# EAGLE design LPC_4TE_3.53controller (EAGLE 5.04)
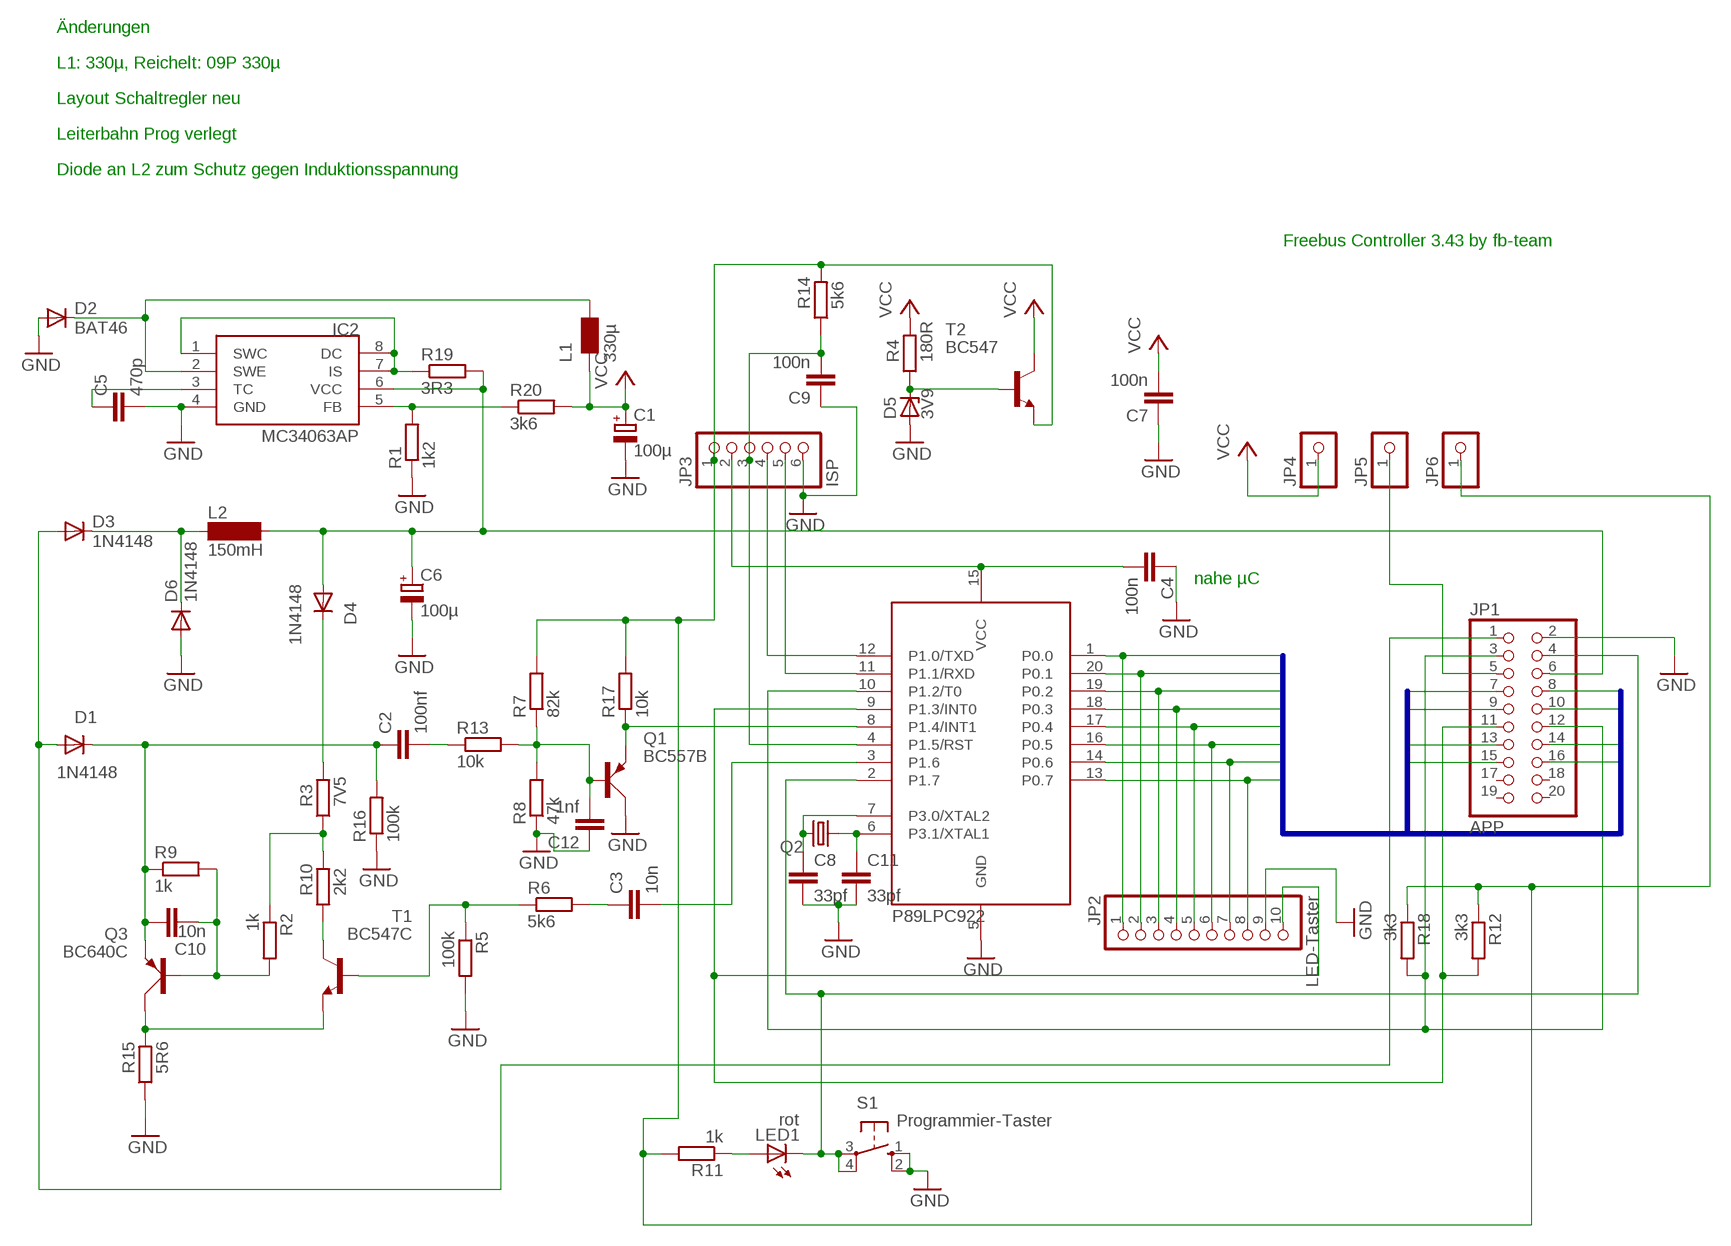
[diagram p0: schematic, sheet 1]

## Parts
C1  100µ  CPOL-EUE5-8.5  [E5-8,5]
C2  100nf  C-EU050-024X044  [C050-024X044]
C3  10n  C-EU050-024X044  [C050-024X044]
C4  100n  C-EU050-024X044  [C050-024X044]
C5  470p  C-EU025-024X044  [C025-024X044]
C6  100µ  CPOL-EUE5-8.5  [E5-8,5]
C7  100n  C-EU050-024X044  [C050-024X044]
C8  33pf  C-EUC1206  [C1206]
C9  100n  C-EU050-024X044  [C050-024X044]
C10  10n  C-EU050-024X044  [C050-024X044]
C11  33pf  C-EUC1206  [C1206]
C12  1nf  C-EU050-024X044  [C050-024X044]
D1  1N4148  1N4148DO35-7  [DO35-7]
D2  BAT46  DIODE-C1702-05  [C1702-05]
D3  1N4148  DIODE-D-2.5  [D-2.5]
D4  1N4148  1N4148DO35-10  [DO35-10]
D5  3V9  BZX85ZD-VL  [RAD2,5L]
D6  1N4148  DIODE-D-2.5  [D-2.5]
IC1  89LPC922FN  89LPC922  [DIL20]
IC2  MC34063AP  [DIL08]
JP1  APP  PINHD-2X10  [2X10]
JP2  LED-Taster  PINHD-1X10  [1X10]
JP3  ISP  PINHD-1X6  [1X06]
JP4  PINHD-1X1  [1X01]
JP5  PINHD-1X1  [1X01]
JP6  PINHD-1X1  [1X01]
L1  330µ  L_R85  [L_RAD_D8RM5]
L2  150mH  SD12-1000  [SD12_1000]
LED1  rot  LED3MM  [LED3MM]
Q1  BC557B  BC557  [SOT54A]
Q2  CRYSTALHC49U70  [HC49U70]
Q3  BC640C  BC640  [SOT54D]
R1  1k2  R-EU_0207/10  [0207/10]
R2  1k  R-EU_0207/7  [0207/7]
R3  7V5  R-EU_0207/7  [0207/7]
R4  180R  R-EU_0207/2V  [0207/2V]
R5  100k  R-EU_0207/2V  [0207/2V]
R6  5k6  R-EU_0207/7  [0207/7]
R7  82k  R-EU_0207/7  [0207/7]
R8  47k  R-EU_0207/7  [0207/7]
R9  1k  R-EU_0207/7  [0207/7]
R10  2k2  R-EU_0207/7  [0207/7]
R11  1k  R-EU_0207/10  [0207/10]
R12  3k3  R-EU_0207/10  [0207/10]
R13  10k  R-EU_0207/7  [0207/7]
R14  5k6  R-EU_0207/10  [0207/10]
R15  5R6  R-EU_0207/2V  [0207/2V]
R16  100k  R-EU_0207/7  [0207/7]
R17  10k  R-EU_0207/7  [0207/7]
R18  3k3  R-EU_0207/10  [0207/10]
R19  3R3  R-EU_0207/10  [0207/10]
R20  3k6  R-EU_0207/10  [0207/10]
S1  Programmier-Taster  10-XX  [B3F-10XX]
T1  BC547C  BC547  [TO92]
T2  BC547  [TO92]

## Nets
/RESTET: C9.2 IC1.4(P1.5/RST) JP3.3 R14.1
DRAIN: C2.1 C10.1 D1.C Q3.E R9.1 R16.2
EIB_DC: C6.+ D4.A IC2.6(VCC) JP1.6 L2.2 R19.2
EIBIN: IC1.8(P1.4/INT1) Q1.E R17.1
GND: C1.- C4.1 C5.2 C6.- C7.1 C8.2 C9.1 C11.2 C12.1 D2.A D5.A D6.A IC1.5(GND) IC2.4(GND) JP1.2 JP2.9 JP3.6 Q1.C R1.1 R5.2 R8.1 R15.1 R16.1 S1.1(S) S1.2(S1)
INT0_TASTER: IC1.9(P1.3/INT0) JP1.11 JP2.10 R12.2
N$1: C3.1 R6.2
N$2: C2.2 R13.1
N$3: IC2.5(FB) R1.2 R20.1
N$4: IC2.1(SWC) IC2.7(IS) IC2.8(DC) R19.1
N$5: C3.2 IC1.3(P1.6)
N$6: R10.1 T1.3(C)
N$7: Q3.C R15.2 T1.1(E)
N$8: D3.C D6.C L2.1
N$9: D4.C R3.2
N$10: D2.C IC2.2(SWE) L1.1
N$11: R2.1 R3.1 R10.2
N$12: R5.1 R6.1 T1.2(B)
N$13: C5.1 IC2.3(TC)
N$14: C12.2 Q1.B R7.1 R8.2 R13.2
N$15: C10.2 Q3.B R2.2 R9.2
N$16: D1.A D3.A JP1.1
N$17: C11.1 IC1.6(P3.1/XTAL1) Q2.1
N$18: D5.C R4.1 T2.2(B)
N$19: C8.1 IC1.7(P3.0/XTAL2) Q2.2
N$20: JP1.5 JP5.1
N$29: IC1.12(P1.0/TXD) JP3.4
N$30: IC1.11(P1.1/RXD) JP3.5
N$41: LED1.A R11.1
P0.0: IC1.1(P0.0) JP1.7 JP2.1
P0.1: IC1.20(P0.1) JP1.8 JP2.2
P0.2: IC1.19(P0.2) JP1.9 JP2.3
P0.3: IC1.18(P0.3) JP1.10 JP2.4
P0.4: IC1.17(P0.4) JP1.13 JP2.5
P0.5: IC1.16(P0.5) JP1.14 JP2.6
P0.6: IC1.14(P0.6) JP1.15 JP2.7
P0.7: IC1.13(P0.7) JP1.16 JP2.8
PROG: IC1.2(P1.7) JP1.4 LED1.K(C) S1.3(P) S1.4(P1)
PWM: IC1.10(P1.2/T0) JP1.3 JP1.12 R18.2
VCC: C1.+ C7.2 JP4.1 L1.2 R4.2 R20.2 T2.3(C)
VCC_3V3: JP3.1 JP6.1 R7.2 R11.2 R12.1 R14.2 R17.2 R18.1 T2.1(E)
VCC_LPC: C4.2 IC1.15(VCC) JP3.2
Unconnected: JP1.17 JP1.18 JP1.19 JP1.20

## Buses
P0.[0..7]

## Notes on the sheet
- Änderungen
- L1: 330µ, Reichelt: 09P 330µ
- Layout Schaltregler neu
- Leiterbahn Prog verlegt
- Diode an L2 zum Schutz gegen Induktionsspannung
- Freebus Controller 3.43 by fb-team
- nahe µC
- P89LPC922

## Library data of the parts
C1 C6 = rcl:CPOL-EU: POLARIZED CAPACITOR, European symbol
C2-C5 C7-C12 = rcl:C-EU: CAPACITOR, European symbol
D1 D4 = diode:1N4148: DIODE high speed (Philips)
D2 D3 D6 = diode:DIODE-: DIODE
D5 = diode:BZX85: Z DIODE
IC1 = micro-philips:89LPC922
IC2 = mc34063:MC34063
JP1 = pinhead:PINHD-2X10: PIN HEADER
JP2 = pinhead:PINHD-1X10: PIN HEADER
JP3 = pinhead:PINHD-1X6: PIN HEADER
JP4-JP6 = pinhead:PINHD-1X1: PIN HEADER
L1 = fbctrls1:L
L2 = inductor-neosid:SD12: INDUCTOR nominal inductance
LED1 = led:LED: LED OSRAM: - CHIPLED LG R971, LG N971, LY N971, LG Q971, LY Q971, LO R971, LY R971 LH N974, LH R974 LS Q976, LO Q976, LY Q976 LO Q996 - Hyper CHIPLED LW Q18S LB Q993, LB Q99A, LB R99A - SideLED LS A670, LO A670, LY A670, LG A670, LP A670 LB A673, LV A673, LT A673, LW A673 LH A674 LY A675 LS A676, LA A676, LO A676, LY A676, LW A676 LS A679, LY A679, LG A679 - Hyper Micro SIDELED® LS Y876, LA Y876, LO Y876, LY Y876 LT Y87S - SmartLED LW L88C, LW L88S LB L89C, LB L89S, LG L890 LS L89K, LO L89K, LY L89K LS L896, LA L896, LO L896, LY L896 - TOPLED LS T670, LO T670, LY T670, LG T670, LP T670 LSG T670, LSP T670, LSY T670, LOP T670, LYG T670 LG T671, LOG T671, LSG T671 LB T673, LV T673, LT T673, LW T673 LH T674 LS T676, LA T676, LO T676, LY T676, LB T676, LH T676, LSB T676, LW T676 LB T67C, LV T67C, LT T67C, LS T67K, LO T67K, LY T67K, LW E67C LS E67B, LA E67B, LO E67B, LY E67B, LB E67C, LV E67C, LT E67C LW T67C LS T679, LY T679, LG T679 LS T770, LO T770, LY T770, LG T770, LP T770 LB T773, LV T773, LT T773, LW T773 LH T774 LS E675, LA E675, LY E675, LS T675 LS T776, LA T776, LO T776, LY T776, LB T776 LHGB T686 LT T68C, LB T68C - Hyper Mini TOPLED® LB M676 - Mini TOPLED Santana® LG M470 LS M47K, LO M47K, LY M47K Source: http://www.osram.convergy.de - LUMILED® LXK2-PW12-R00, LXK2-PW12-S00, LXK2-PW14-U00, LXK2-PW14-V00 LXK2-PM12-R00, LXK2-PM12-S00, LXK2-PM14-U00 LXK2-PE12-Q00, LXK2-PE12-R00, LXK2-PE12-S00, LXK2-PE14-T00, LXK2-PE14-U00 LXK2-PB12-K00, LXK2-PB12-L00, LXK2-PB12-M00, LXK2-PB14-N00, LXK2-PB14-P00, LXK2-PB14-Q00 LXK2-PR12-L00, LXK2-PR12-M00, LXK2-PR14-Q00, LXK2-PR14-R00 LXK2-PD12-Q00, LXK2-PD12-R00, LXK2-PD12-S00 LXK2-PH12-R00, LXK2-PH12-S00 LXK2-PL12-P00, LXK2-PL12-Q00, LXK2-PL12-R00 Source: www.luxeon.com
Q1 = transistor-small-signal:BC557: PNP TRANSISTOR
Q2 = crystal:CRYSTAL: CRYSTAL
Q3 = transistor-small-signal:BC640: PNP TRANSISTOR
R1-R20 = rcl:R-EU_: RESISTOR, European symbol
S1 = switch-omron:10-XX: OMRON SWITCH
T1 T2 = transistor:BC547: NPN TRANSISTOR

## Board
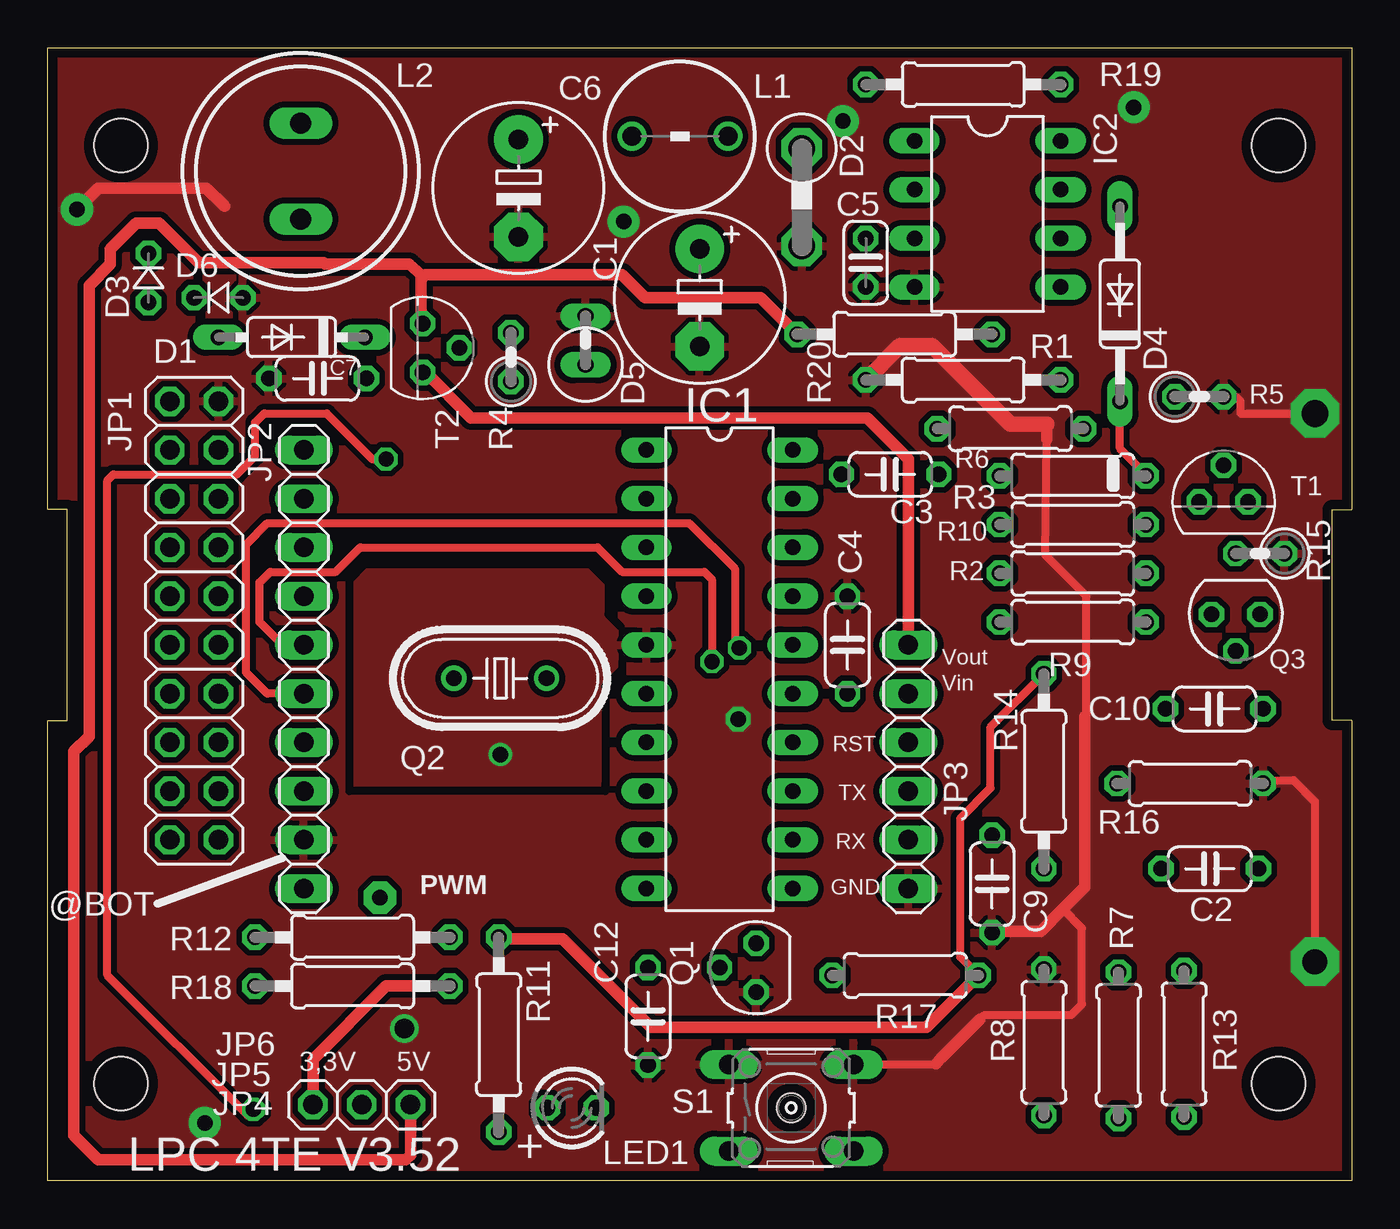
[diagram p1: board, top side]
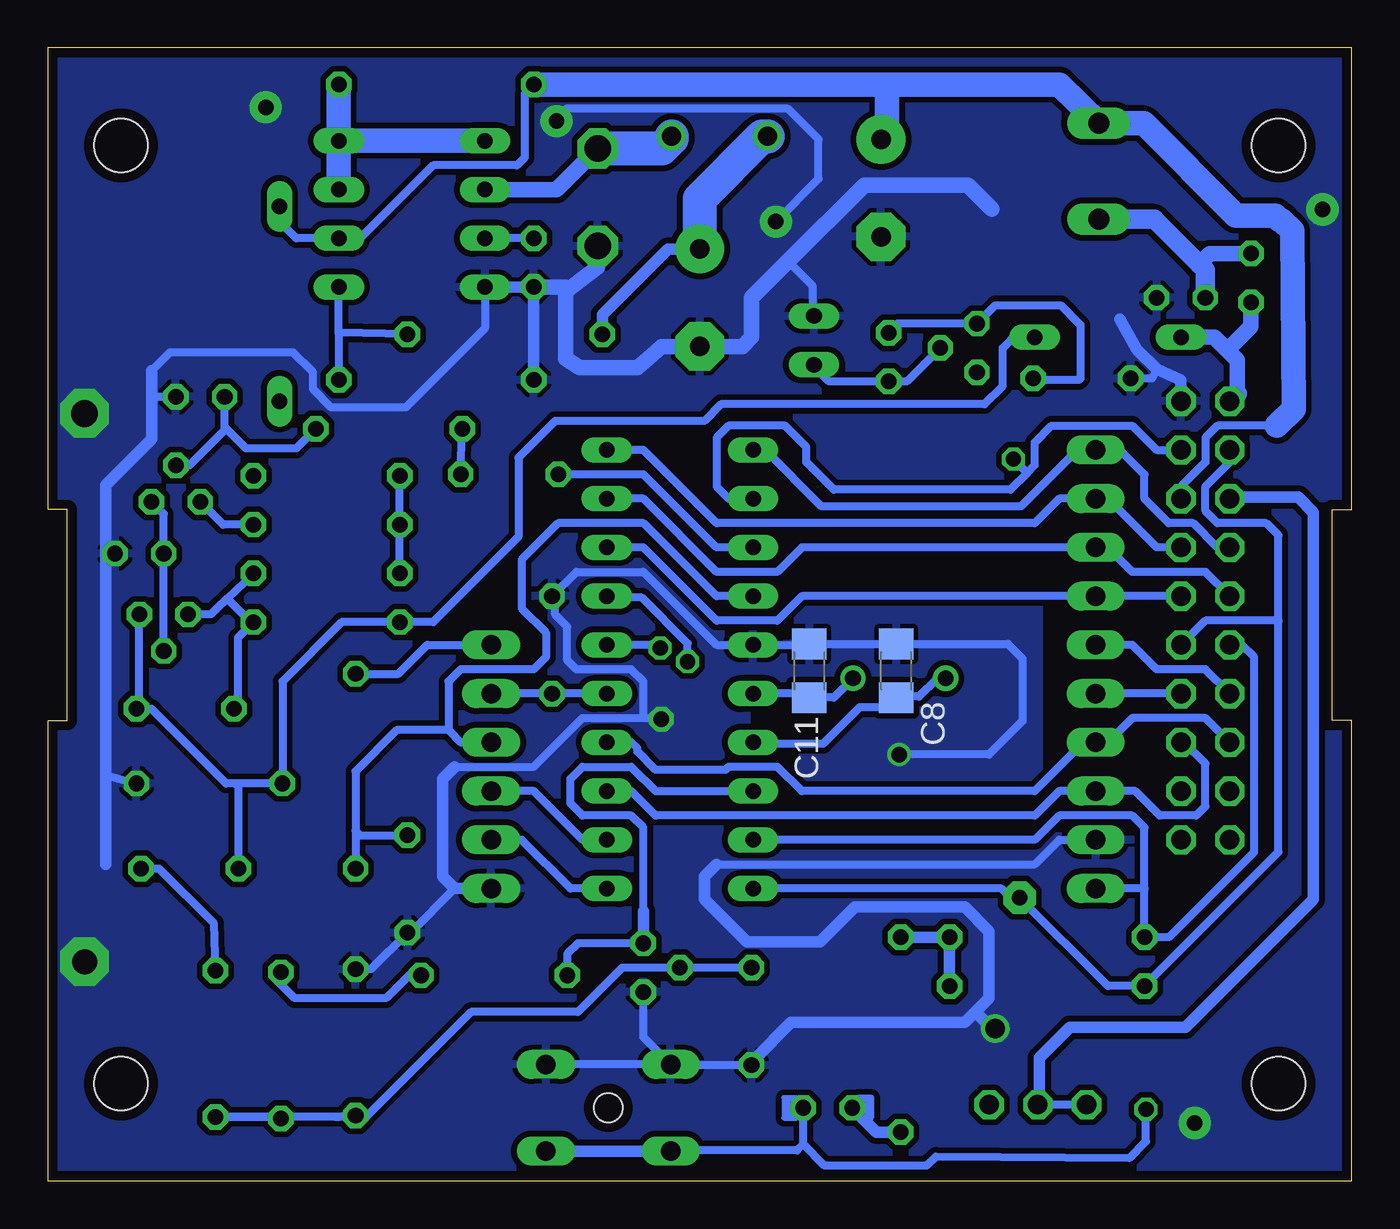
[diagram p2: board, bottom side, seen from below]

Size 67.94 x 59.05 mm. Coordinates in mm from the lower left corner, seen from the top.
Outline: 0,0 0,24 1,24 1,35 0,35 0,59.05 67.94,59.05 67.94,35 66.94,35 66.94,24 67.94,24 67.94,0 0,0
Copper layers (1*16): Top 0.035mm / dielectric 1.5mm / Bottom 0.035mm
Design rules "default *": minimum track width 10mil, minimum drill 24mil, track to track 12mil, track to pad 12mil, pad to pad 12mil, via to via 12mil, smd to smd 8mil, copper to edge 20mil, drill to drill 8mil, minimum pad ring 10mil, minimum via ring 8mil, stop-mask expansion 4mil, vias tented up to drill 0mil, thermal gap 10mil
Holes 2.8 mm at 3.81,53.98 64.14,53.98 64.14,5.08 3.81,5.08
Holes 1.5 mm at 38.73,3.81
tRestrict: 11 lines
bRestrict: 3 lines

### Footprints (pad centres in the part's own frame; a part is rotated, then mirrored left to right if it is on the bottom)
E5-8,5 = drill 1.016 pad 2.54 round: + -2.54,0 | drill 1.016 pad 2.54 octagon: - 2.54,0
C050-024X044 = drill 0.813 octagon: 1 -2.54,0; 2 2.54,0
C025-024X044 = drill 0.813 octagon: 1 -1.27,0; 2 1.27,0
C1206 = smd 1.6 x 1.8: 1 -1.4,0; 2 1.4,0
DO35-7 = drill 0.813 long: A 3.81,0; C -3.81,0
C1702-05 = drill 1.397 octagon: A 2.54,0; C -2.54,0
D-2.5 = drill 0.813 octagon: A 1.27,0; C -1.27,0
DO35-10 = drill 0.813 long: A 5.08,0; C -5.08,0
RAD2,5L = drill 0.813 long: A 1.27,0; C -1.27,0
DIL20 = drill 0.813 long: 1 -11.43,-3.81; 2 -8.89,-3.81; 3 -6.35,-3.81; 4 -3.81,-3.81; 5 -1.27,-3.81; 6 1.27,-3.81; 7 3.81,-3.81; 8 6.35,-3.81; 9 8.89,-3.81; 10 11.43,-3.81; 11 11.43,3.81; 12 8.89,3.81; 13 6.35,3.81; 14 3.81,3.81; 15 1.27,3.81; 16 -1.27,3.81; 17 -3.81,3.81; 18 -6.35,3.81; 19 -8.89,3.81; 20 -11.43,3.81
DIL08 = drill 0.813 long: 1 -3.81,-3.81; 2 -1.27,-3.81; 3 1.27,-3.81; 4 3.81,-3.81; 5 3.81,3.81; 6 1.27,3.81; 7 -1.27,3.81; 8 -3.81,3.81
2X10 = drill 1.016 octagon: 1 -11.43,-1.27; 2 -11.43,1.27; 3 -8.89,-1.27; 4 -8.89,1.27; 5 -6.35,-1.27; 6 -6.35,1.27; 7 -3.81,-1.27; 8 -3.81,1.27; 9 -1.27,-1.27; 10 -1.27,1.27; 11 1.27,-1.27; 12 1.27,1.27; 13 3.81,-1.27; 14 3.81,1.27; 15 6.35,-1.27; 16 6.35,1.27; 17 8.89,-1.27; 18 8.89,1.27; 19 11.43,-1.27; 20 11.43,1.27
1X10 = drill 1.016 long: 1 -11.43,0; 2 -8.89,0; 3 -6.35,0; 4 -3.81,0; 5 -1.27,0; 6 1.27,0; 7 3.81,0; 8 6.35,0; 9 8.89,0; 10 11.43,0
1X06 = drill 1.016 long: 1 -6.35,0; 2 -3.81,0; 3 -1.27,0; 4 1.27,0; 5 3.81,0; 6 6.35,0
1X01 = drill 1.016 octagon: 1 0,0
L_RAD_D8RM5 = drill 1 round: 1 -2.5,0; 2 2.5,0
SD12_1000 = drill 1.1 long: 1 -2.5,0; 2 2.5,0
LED3MM = drill 0.813 octagon: A -1.27,0; K 1.27,0
SOT54A = drill 0.813 octagon: B 0,1.905; C -1.27,0; E 1.27,0
HC49U70 = drill 0.813 round: 1 -2.413,0; 2 2.413,0
SOT54D = drill 0.813 octagon: B 1.27,0; C 0,1.905; E -1.27,0
0207/10 = drill 0.813 octagon: 1 -5.08,0; 2 5.08,0
0207/7 = drill 0.813 octagon: 1 -3.81,0; 2 3.81,0
0207/2V = drill 0.813 octagon: 1 -1.27,0; 2 1.27,0
B3F-10XX = drill 1.016 long: 1 -3.251,2.261; 2 3.251,2.261; 3 -3.251,-2.261; 4 3.251,-2.261
TO92 = drill 0.813 octagon: 1 1.27,0; 2 0,1.905; 3 -1.27,0

### Placement (x,y rotation side)
C1  33.97,46.04 270 top
C2  60.56,16.27 0 top
C3  43.89,36.83 180 top
C4  41.67,27.94 270 top
C5  42.62,47.86 270 top
C6  24.53,51.75 270 top
C7  14.05,41.83 0 top
C8  23.73,26.59 90 bottom
C9  49.21,15.48 90 top
C10  60.8,24.61 180 top
C11  28.26,26.59 90 bottom
C12  31.27,8.57 90 top
D1  12.7,43.97 180 top
D2  39.29,51.28 270 top
D3  5.24,47.07 270 top
D4  55.88,45.72 90 top
D5  28.02,43.81 90 top
D6  8.89,46.04 0 top
IC1  35,26.67 270 top
IC2  48.97,50.4 270 top
JP1  7.62,29.21 270 top
JP2  13.34,26.67 270 top
JP3  44.85,21.59 270 top
JP4  18.89,3.97 0 top
JP5  16.35,3.97 0 top
JP6  13.81,3.97 0 top
L1  32.94,54.45 180 top
L2  13.18,52.63 90 top
LED1  27.3,3.81 0 top
Q1  36.91,11.11 90 top
Q2  23.57,26.19 180 top
Q3  61.91,29.53 180 top
R1  47.7,41.75 0 top
R2  53.42,31.67 0 top
R3  53.42,36.75 0 top
R4  24.13,42.94 90 top
R5  60.01,40.88 0 top
R6  50.16,39.21 180 top
R7  55.8,7.06 90 top
R8  51.91,7.22 270 top
R9  53.42,29.13 0 top
R10  53.42,34.21 180 top
R11  23.5,7.62 90 top
R12  15.88,12.7 180 top
R13  59.21,7.14 270 top
R14  51.91,21.35 90 top
R15  63.18,32.7 180 top
R16  59.53,20.72 180 top
R17  44.69,10.72 0 top
R18  15.88,10.16 180 top
R19  47.7,57.15 180 top
R20  44.13,44.13 180 top
S1  38.73,3.81 0 top
T1  61.28,35.4 0 top
T2  19.53,43.42 270 top

### Tracks (layer width: path | path; a pad name or v marks a point on that pad's centre or on a via)
/RESTET
  Bottom 0.406: IC1.4 33.1,30.48 36.91,34.29 41.35,34.29 43.26,32.38 43.26,29.84 41.99,28.57 41.99,27.3 42.62,26.67 46.43,26.67 47.07,26.04 47.07,23.5 | JP3.3 46.43,22.86 47.07,23.5 | 51.91,18.26 51.91,21.35 49.77,23.5 47.07,23.5 | 51.91,18.26 R14.1 | C9.2 51.67,18.02 51.91,18.26
DRAIN
  Bottom 0.406: Q3.E 63.18,24.77 C10.1 62.55,24.61 58.66,20.72 58.18,20.72 | R9.1 47.86,29.13 43.42,33.58 43.42,37.7 41.51,39.61 33.73,39.61 32.86,40.48 19.13,40.48 18.18,41.43 18.18,43.42 17.38,44.21 16.75,44.21 D1.C | R9.1 | R16.2 58.18,20.72 | C2.1 58.02,20.56 58.18,20.72 | R9.1 52.63,29.13 55.72,26.04 R16.2 | R16.2
EIB_DC
  Bottom 0.406: JP1.6 8.89,36.2 7.62,37.47 7.62,38.73 6.99,39.37 3.89,39.37 | R19.2 43.1,56.67 43.1,53.82 43.1,53.34 43.5,52.94 47.86,52.94 51.67,49.13 IC2.6 55.01,49.13 55.88,50.01 D4.A | D4.A
  Bottom 1.27: 3.89,39.37 3.02,40.24 3.1,49.45 3.1,49.53 3.65,50.09 3.73,50.09 3.97,50.32 6.03,50.32 10.83,55.13 L2.2 15.24,57.15 24.21,57.15 | 24.21,57.15 R19.2 | C6.+ 24.21,54.61 24.21,57.15
EIBIN
  Bottom 0.406: IC1.8 36.27,20.32 37.54,21.59 40.08,21.59 40.72,20.95 40.72,19.68 40.08,19.05 37.54,19.05 36.91,18.41 36.91,13.89 | Q1.E 40.32,12.38 40.88,11.83 R17.1 | R17.1
  Bottom 0.61: 36.91,14.05 36.91,13.89 Q1.E
GND  (via drill 0.8, 0.8 pad 1.27, 0.8 pad 1.68, 1, 1.3 pad 2.54, 1.4 pad 2.54)
  Top 0.406: v66.04,40.01 62.15,40.01 62.15,40.64 61.91,40.88 R5.2 | 52.07,38.66 51.99,32.62 54.13,30.48 54.13,24.29 54.05,24.21 | v66.04,11.43 66.04,19.76 64.93,20.88 63.5,20.88 R16.1 | 48.58,8.41 48.82,8.65 53.34,8.65 53.9,9.21 53.9,13.18 52.9,14.17 | S1.2 46.23,6.07 46.55,6.39
  Top 0.61: 54.05,24.21 54.05,15.32 52.9,14.17 51.75,13.02 49.29,13.02 C9.1 | 52.07,38.66 52.07,39.45 | 48.58,8.41 46.55,6.39 46.28,6.11 | v1.51,50.64 2.62,51.75 8.26,51.75 9.21,50.8
  Top 0.813: 52.07,39.45 50.16,39.45 46.08,43.54 44.41,43.54 R1.1
  Bottom 0.406: 36.91,24.13 36.91,26.04 37.54,26.67 40.4,26.67 40.88,27.15 40.88,28.89 41.51,29.53 41.51,30.32 C4.1 | 36.91,24.13 40.08,24.13 42.62,21.59 46.75,21.59 | JP2.9 15.24,17.78 16.51,16.51 33.1,16.51 | C4.1 40.4,31.75 36.91,31.75 33.1,27.94 IC1.5 28.31,27.94 C11.2 C8.2 17.91,27.99 17.14,27.23 17.14,23.97 18.89,22.23 v23.57,22.23 | D5.A 28.1,45.09 28.1,46.67 29.37,47.94 30.16,47.15 | 62.55,40.88 R5.2 | 62.55,40.88 | R15.1 64.85,32.7 64.93,32.78 | Q1.C 36.91,7.5 S1.1 | S1.1 S1.2 | 46.75,15.24 49.05,12.94 C9.1 51.12,11.03 R8.1 | 64.93,16.51 64.93,20.95 64.77,21.11 R16.1 | 31.83,6.03 C12.1 | 31.83,6.03 35.24,6.03 35.32,6.11 | 35.32,6.11 35.24,6.19 | 31.11,6.35 31.51,6.35 31.83,6.03 | S1.1 35.36,6.07 35.32,6.11 | IC2.4 45.16,44.45 49.29,40.32 53.18,40.32 54.13,41.27 54.13,42.15 55.17,43.18 61.59,43.18 62.55,42.23 | C4.1 | v35.98,24.07 36.6,24.13 36.91,24.13 | C7.1 10.4,41.83 10.16,42.31 | 40.96,55.88 29.37,55.88 27.78,54.29 27.78,52.23 v30,50.01
  Bottom 0.61: JP3.6 46.75,15.24 47.39,15.88 47.39,20.95 46.75,21.59 | S1.1 35.48,6.27 35.56,6.35 | 33.1,16.51 33.73,15.88 33.73,14.68 31.51,12.46 27.7,12.46 25.88,14.29 20.16,14.29 18.89,13.02 18.89,9.53 19.61,8.81 | 31.11,6.35 29.21,8.26 20.16,8.26 19.61,8.81 | JP1.2 8.89,41.75 10.16,42.31 11.19,43.34 12.06,44.93 | IC2.4 C5.2 R1.1 | 62.55,42.23 62.55,40.88 62.55,38.66 64.93,36.27 64.93,32.78 64.93,16.51 | v18.57,7.94 18.34,7.54 19.61,8.81
  Bottom 0.813: 40.96,46.35 40.96,42.86 40.24,42.39 37.23,42.39 36.67,42.86 35.96,43.5 C1.- 31.75,43.5 31.27,43.97 31.27,46.04 29.37,47.94 25.4,51.91 20,51.91 18.73,50.64 | 40.96,46.35 40.96,46.59 C5.2 | D2.A 39.29,47.62 40.96,46.35
  other vias: 8.18,3.02 56.59,55.96 41.43,55.24
  pour Bottom: -0.16,0 0,59.05 67.94,59.05 67.94,0
  pour Top: -0.16,59.37 -0.16,-0.32 68.26,-0.32 68.26,59.21 0.32,59.21
INT0_TASTER
  Bottom 0.406: IC1.9 16.51,17.78 15.24,19.05 11.43,19.05 10.79,18.41 10.79,15.24 | JP1.11 5.71,27.94 5.08,27.3 5.08,17.14 9.53,12.7 R12.2 10.79,15.24 | 10.79,15.24 JP2.10
N$1
  Bottom 0.406: C3.1 R6.2
N$2
  Bottom 0.406: C2.2 62.15,16.27 59.29,13.41 R13.1 | C2.2
N$3
  Bottom 0.406: 52.78,44.13 R1.2 | 52.78,44.13 IC2.5 | R20.1 52.7,44.21 52.78,44.13
N$4
  Bottom 1.27: IC2.1 IC2.8 | IC2.8 IC2.7 | IC2.8 R19.1
N$5
  Bottom 0.406: IC1.3 33.1,33.02 36.91,36.83 C3.2
N$6
  Bottom 0.406: R10.1 58.82,34.21 T1.3
N$7
  Bottom 0.406: Q3.C R15.2 61.91,34.77 T1.1
N$8
  Bottom 0.813: D3.C 7.38,48.34 7.94,47.78
  Bottom 1.016: D6.C 7.62,47.47 7.94,47.78 10.28,50.13 L2.1
N$9
  Top 0.406: R3.2 57.23,36.83 55.88,38.18 D4.C | D4.C
N$10
  Bottom 0.813: IC2.2 41.43,51.67 D2.C
  Bottom 1.778: L1.1 35.44,54.33 35.96,53.82 D2.C
N$11
  Bottom 0.406: R10.2 R3.1 | R10.2 | R2.1 R10.2 | R2.1
N$12
  Bottom 0.406: 58.66,39.21 57.63,38.18 55.01,38.18 R6.1 | 58.66,39.21 58.74,39.29 R5.1 | R5.1 | T1.2 60.56,37.31 58.66,39.21
N$13
  Bottom 0.406: C5.1 IC2.3
N$14
  Bottom 0.406: R7.1 56.28,3.33 R13.2 52.94,3.33 R8.2 52.78,3.33 51.36,3.33 45.88,8.81 40.32,8.81 38.02,11.11 Q1.B C12.2 | C12.2
N$15
  Bottom 0.406: Q3.B 59.45,29.53 59.17,29.8 58.6,30.36 | 58.6,30.36 R2.2 | C10.2 58.02,24.84 58.02,28.34 R9.2 57.37,29.13 58.6,30.36
N$16
  Bottom 0.61: JP1.1 6.27,40.72
  Bottom 0.813: 5.95,41.04 5.95,42.78 6.47,43.3 | 6.47,43.3 7.14,43.97 D1.A | D3.A 5.24,44.53 6.47,43.3
  Bottom 1.016: 6.27,40.72 5.95,41.04
N$17
  Bottom 0.406: IC1.6 28.47,25.4 C11.1 26.99,25.19 Q2.1
N$18
  Bottom 0.406: D5.C 28.02,42.47 27.23,41.67 R4.1 23.18,41.67 T2.2
N$19
  Bottom 0.406: Q2.2 21.59,26.19 22.54,25.24 23.68,25.24 C8.1 23.94,25.19 24.45,24.69 25.64,24.69 27.54,22.78 31.11,22.78 IC1.7
N$20
  Bottom 0.61: JP5.1 16.27,4.05 16.27,6.43 14.68,8.02 8.65,8.02 1.98,14.68 1.98,34.85 2.78,35.64 6.27,35.64 JP1.5
N$29
  Bottom 0.406: IC1.12 40.08,17.78 42.62,20.32 JP3.4
N$30
  Bottom 0.406: IC1.11 40.72,15.24 43.26,17.78 JP3.5
N$41
  Bottom 0.254: 25.66,4.32 25.68,4.32 25.72,4.36 25.02,4.36 25,4.34 25,3.33 25.06,3.27 25.71,3.27 25.72,3.28 25.72,3.3 | 25.72,3.3 25.48,3.54 25.48,4.13 25.45,4.16 25.23,4.16 25.22,4.17 25.22,3.47 25.34,3.47 25.36,3.48 25.36,4.06 25.36,4.07 | 25.72,3.3 25.72,3.31 25.63,3.4
  Bottom 0.61: R11.1 24.77,2.54 25.63,3.4 LED1.A
P0.0
  Bottom 0.406: JP1.7 6.99,33.02 8.26,34.29 9.53,34.29 10.79,35.56 10.79,36.83 12.06,38.1 JP2.1 14.29,38.1 17.22,35.16 27.62,35.16 30.56,38.1 IC1.1
P0.1
  Bottom 0.406: IC1.20 36.91,38.1 33.1,34.29 16.51,34.29 15.24,35.56 JP2.2 12.7,35.56 10.16,33.02 JP1.8
P0.2
  Bottom 0.406: JP1.9 7.62,31.75 11.43,31.75 12.7,33.02 JP2.3 28.65,33.02 29.92,31.75 33.1,31.75 36.91,35.56 IC1.19
P0.3
  Bottom 0.406: IC1.18 36.91,33.02 33.1,29.21 29.92,29.21 28.65,30.48 JP2.4 JP1.10
P0.4  (via drill 0.8)
  Top 0.406: JP2.5 12.22,27.94 11.03,29.13 11.03,31.19 11.59,31.75 15,31.75 16.27,33.02 28.65,33.02 29.92,31.75 34.21,31.75 34.61,31.35 v34.61,27.07
  Bottom 0.406: JP1.13 7.62,26.67 10.16,26.67 11.43,27.94 JP2.5 | v34.61,27.07 34.61,28.02 36.99,30.4 38.73,30.4 IC1.17
P0.5  (via drill 0.8)
  Top 0.406: JP2.6 11.43,25.4 10.32,26.51 10.32,33.18 11.43,34.29 33.42,34.29 35.8,31.91 35.8,28.02 v36.04,27.78
  Bottom 0.406: JP1.14 JP2.6 | v36.04,27.78 36.27,27.78 36.43,27.94 IC1.16
P0.6
  Bottom 0.406: JP1.15 7.62,24.13 11.43,24.13 12.7,22.86 JP2.7 13.97,22.86 16.51,20.32 28.65,20.32 29.92,21.59 32.46,21.59 32.62,21.43 36.27,21.43 | IC1.14 37.54,22.86 37.23,22.54 37.23,22.38 36.27,21.43 | 36.27,21.43
P0.7
  Bottom 0.406: IC1.13 37.54,20.32 36.27,19.05 16.51,19.05 15.24,20.32 JP2.8 11.27,20.32 10,19.05 8.1,19.05 7.62,19.53 7.62,21.75 8.73,22.86 JP1.16
PROG  (via drill 0.8)
  Top 0.406: v17.62,37.62 16.91,37.62 14.53,40.01 11.27,40.01 10.79,39.53 10.79,37.78 9.84,36.83 3.41,36.83 3.1,36.51 3.1,10.72 10.4,3.41 v10.72,3.73
  Bottom 0.254: 29.21,4.24 29.37,4.24 29.37,3.44 29.02,3.25 28.96,3.25 28.96,3.26 29.44,3.26 29.59,3.27 29.59,4.34 28.94,4.34 28.94,4.17 LED1.K
  Bottom 0.406: JP1.4 10.16,38.1 11.43,39.37 15.64,39.37 16.51,38.5 16.51,37.31 16.91,36.91 | IC1.2 32.46,35.56 33.1,36.2 33.1,38.73 32.46,39.37 29.53,39.37 28.42,38.26 28.42,37.47 26.99,36.04 17.78,36.04 16.91,36.91 | 28.57,1.91 LED1.K | 28.57,1.91 28.89,1.59 35.45,1.59 S1.3 | v17.62,37.62 16.91,36.91 | v10.72,3.73 10.72,2.06 11.59,1.19 21.67,1.27 22.15,0.79 27.46,0.79 28.57,1.91
  Bottom 0.61: 35.56,1.55 S1.3 34.57,1.55 | 35.56,1.55 S1.4 | 35.56,1.55 35.56,1.27
PWM  (via drill 0.8 pad 1.68)
  Bottom 0.406: v17.3,14.76 17.78,15.24 | v17.3,14.76 17.78,14.76 18.26,15.24 IC1.10 | 3.81,29.21 3.81,17.14 R18.2 12.7,10.16 v17.3,14.76 | 3.81,29.21 7.62,29.21 JP1.12 | JP1.3 6.35,37.47 7.62,36.2 7.62,34.92 6.99,34.29 4.45,34.29 3.81,33.66 3.81,29.21
VCC
  Top 0.61: JP4.1 18.89,1.35 18.65,1.11 2.62,1.11 1.35,2.38 1.35,22.38 2.14,23.18 2.14,46.67 3.25,47.78 3.25,48.58 4.6,49.93 5.79,49.93 7.86,47.86 14.37,47.86 14.45,47.78 16.67,47.78 18.81,47.78 19.45,47.23 19.45,46.99 | 19.45,46.99 19.45,44.77 T2.3 | R20.2 37.15,46.04 31.11,46.04 29.92,47.23 19.68,47.23 19.45,46.99
  Bottom 0.406: R4.2 23.65,44.69 T2.3 18.57,45.64 15.16,45.64 14.13,44.61 14.13,41.83 14.21,41.75 16.51,41.75 C7.2
  Bottom 0.61: C1.+ 35.64,48.58 39.05,45.16 R20.2
  Bottom 1.778: L1.2 30.72,54.45 33.97,51.2 C1.+ | C1.+
VCC_3V3
  Top 0.406: R17.2 47.55,11.67 47.55,18.89 49.13,20.48 49.13,23.65 R14.2
  Top 0.61: JP6.1 13.81,6.35 17.62,10.16 R18.1 | T2.1 19.68,42.15 22.07,39.77 42.7,39.77 44.85,37.62 JP3.1 | R11.2 23.57,12.62 26.83,12.62 31.43,8.02 45.8,8.02 R17.2
  Bottom 0.406: JP6.1 16.27,3.97 | R7.2 56.2,10.64 55.09,9.53 50.32,9.53 49.13,10.72 R17.2 | JP3.1 48.18,27.94 49.69,26.43 R14.2
  Bottom 0.61: R18.1 R12.1 R11.2
VCC_LPC
  Bottom 0.406: IC1.15 C4.2 | C4.2 | C4.2 JP3.2 | JP3.2

### Text on the board
tPlace: Vout | Vin | RST | TX | RX | @BOT | PWM | GND | 3,3V | 5V | +
tNames: LPC 4TE V3.52
tValues: auf Lötseite: